# EAGLE design OPA4134 Headphones (EAGLE 7.6.0)
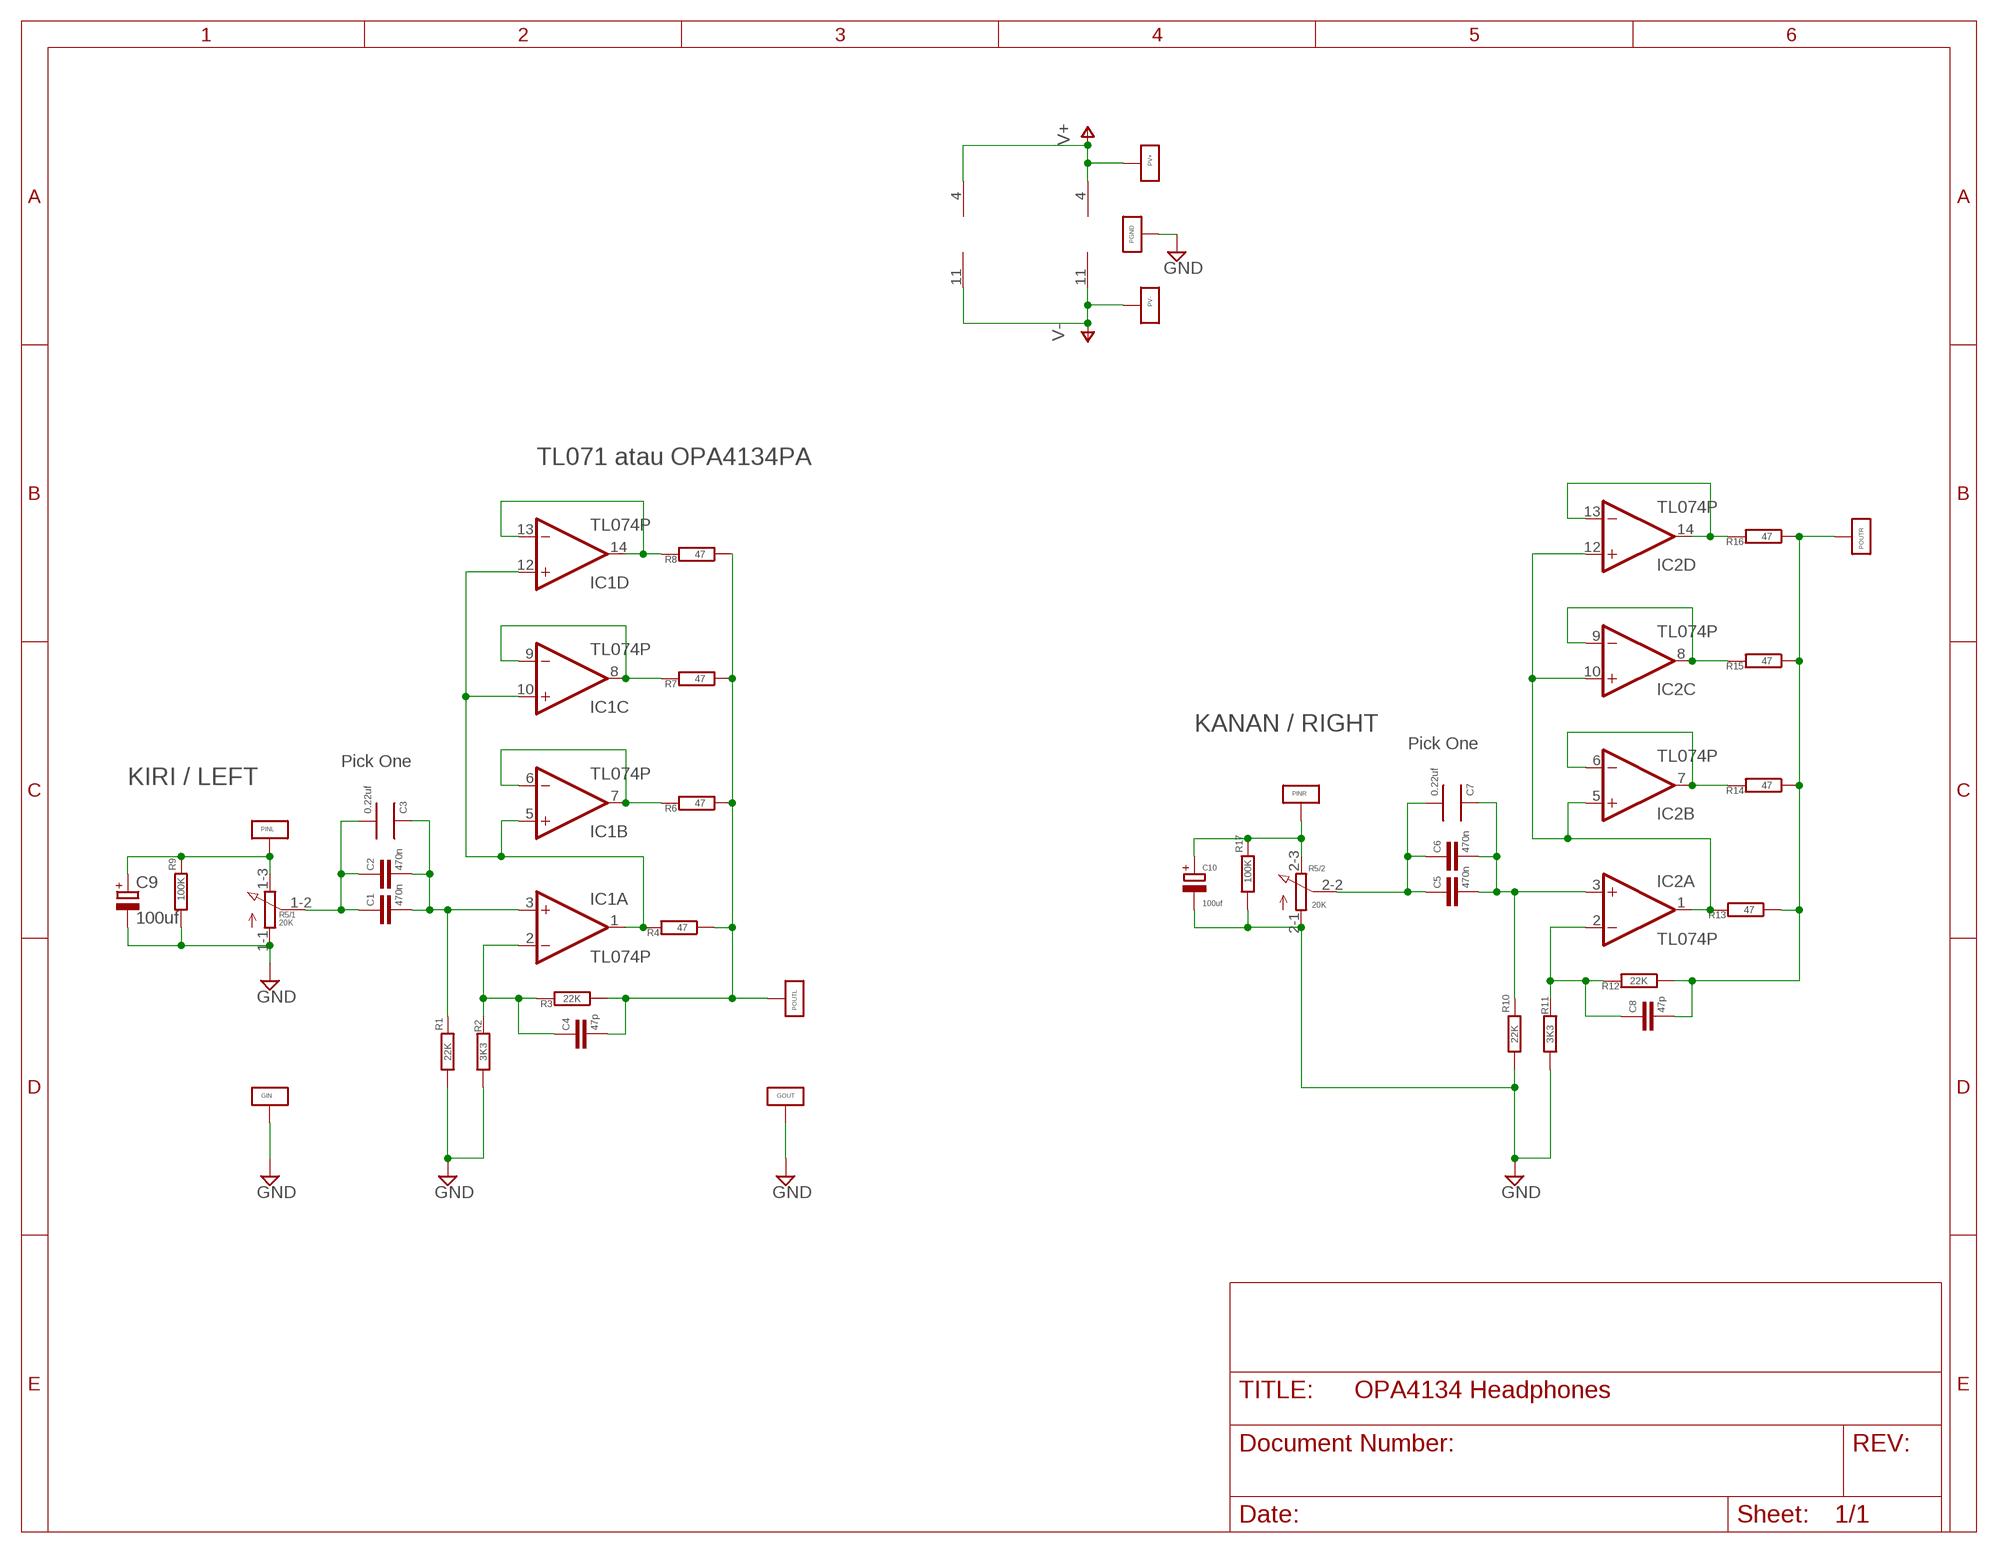
[diagram p0: schematic, sheet 1]

## Parts
C1  470n  C-EU050-025X075  [C050-025X075]
C2  470n  C-EU102-054X133  [C102-054X133]
C3  0.22uf  BENICCAPBENIC-SMALL  [BENICCAP]
C4  47p  C-EU050-025X075  [C050-025X075]
C5  470n  C-EU050-025X075  [C050-025X075]
C6  470n  C-EU102-054X133  [C102-054X133]
C7  0.22uf  BENICCAPBENIC-SMALL  [BENICCAP]
C8  47p  C-EU050-025X075  [C050-025X075]
C9  100uf  CPOL-EUE2.5-7  [E2,5-7]
C10  100uf  CPOL-EUE2.5-7  [E2,5-7]
GIN  PIN-BIG1X  [PIN-BIG]
GOUT  PIN-BIG1X  [PIN-BIG]
IC1  TL074P  [DIL14]
IC2  TL074P  [DIL14]
PGND  PIN-BIG1X  [PIN-BIG]
PINL  PIN-BIG1X  [PIN-BIG]
PINR  PIN-BIG1X  [PIN-BIG]
POUTL  PIN-BIG1X  [PIN-BIG]
POUTR  PIN-BIG1X  [PIN-BIG]
PV+  PIN-BIG1X  [PIN-BIG]
PV-  PIN-BIG1X  [PIN-BIG]
R1  22K  R-EU_0204/7  [0204/7]
R2  3K3  R-EU_0204/7  [0204/7]
R3  22K  R-EU_0204/7  [0204/7]
R4  47  R-EU_0204/7  [0204/7]
R5  20K  3RP/1610G  [3RP/1610G]
R6  47  R-EU_0204/7  [0204/7]
R7  47  R-EU_0204/7  [0204/7]
R8  47  R-EU_0204/7  [0204/7]
R9  100K  R-EU_0204/7  [0204/7]
R10  22K  R-EU_0204/7  [0204/7]
R11  3K3  R-EU_0204/7  [0204/7]
R12  22K  R-EU_0204/7  [0204/7]
R13  47  R-EU_0204/7  [0204/7]
R14  47  R-EU_0204/7  [0204/7]
R15  47  R-EU_0204/7  [0204/7]
R16  47  R-EU_0204/7  [0204/7]
R17  100K  R-EU_0204/7  [0204/7]

## Nets
GND: C9.- C10.- GIN.P$1 GOUT.P$1 PGND.P$1 R1.1 R2.1 R5.1-1(/1:A) R5.2-1(/2:A) R9.1 R10.1 R11.1 R17.1
N$1: C1.1 C2.1 C3.PIN1 R5.1-2(/1:S)
N$2: C1.2 C2.2 C3.PIN2 IC1.3(A:+IN) R1.2
N$3: IC1.6(B:-IN) IC1.7(B:OUT) R6.2
N$4: C4.1 IC1.2(A:-IN) R2.2 R3.2
N$5: IC1.1(A:OUT) IC1.5(B:+IN) IC1.10(C:+IN) IC1.12(D:+IN) R4.2
N$6: C4.2 POUTL.P$1 R3.1 R4.1 R6.1 R7.1 R8.1
N$7: C10.+ PINR.P$1 R5.2-3(/2:E) R17.2
N$8: IC1.8(C:OUT) IC1.9(C:-IN) R7.2
N$9: IC1.13(D:-IN) IC1.14(D:OUT) R8.2
N$10: C5.1 C6.1 C7.PIN1 R5.2-2(/2:S)
N$11: C5.2 C6.2 C7.PIN2 IC2.3(A:+IN) R10.2
N$12: C8.1 IC2.2(A:-IN) R11.2 R12.2
N$13: IC2.1(A:OUT) IC2.5(B:+IN) IC2.10(C:+IN) IC2.12(D:+IN) R13.2
N$14: C8.2 POUTR.P$1 R12.1 R13.1 R14.1 R15.1 R16.1
N$15: IC2.6(B:-IN) IC2.7(B:OUT) R14.2
N$16: IC2.8(C:OUT) IC2.9(C:-IN) R15.2
N$17: IC2.13(D:-IN) IC2.14(D:OUT) R16.2
N$18: C9.+ PINL.P$1 R5.1-3(/1:E) R9.2
V+: IC1.4(P:V+) IC2.4(P:V+) PV+.P$1
V-: IC1.11(P:V-) IC2.11(P:V-) PV-.P$1

## Notes on the sheet
- TL071 atau OPA4134PA
- KANAN / RIGHT
- Pick One
- Pick One
- KIRI / LEFT

## Library data of the parts
C1 C2 C4-C6 C8 = resistor:C-EU: CAPACITOR, European symbol
C3 C7 = ioshub:BENICCAP: Benic Capacitor Small
C9 C10 = resistor:CPOL-EU: POLARIZED CAPACITOR, European symbol
GIN GOUT PGND PINL PINR POUTL POUTR PV+ PV- = ioshub:PIN-BIG: 1X 1.0 mm pin big
IC1 IC2 = linear:TL074: OP AMP
R1-R4 R6-R17 = resistor:R-EU_: RESISTOR, European symbol
R5 = pot2:3RP/1610G: 16mm Potentiometer two level Source: http://www.alphapotentiometers.net/html/16mm_pot_2.html

## Board
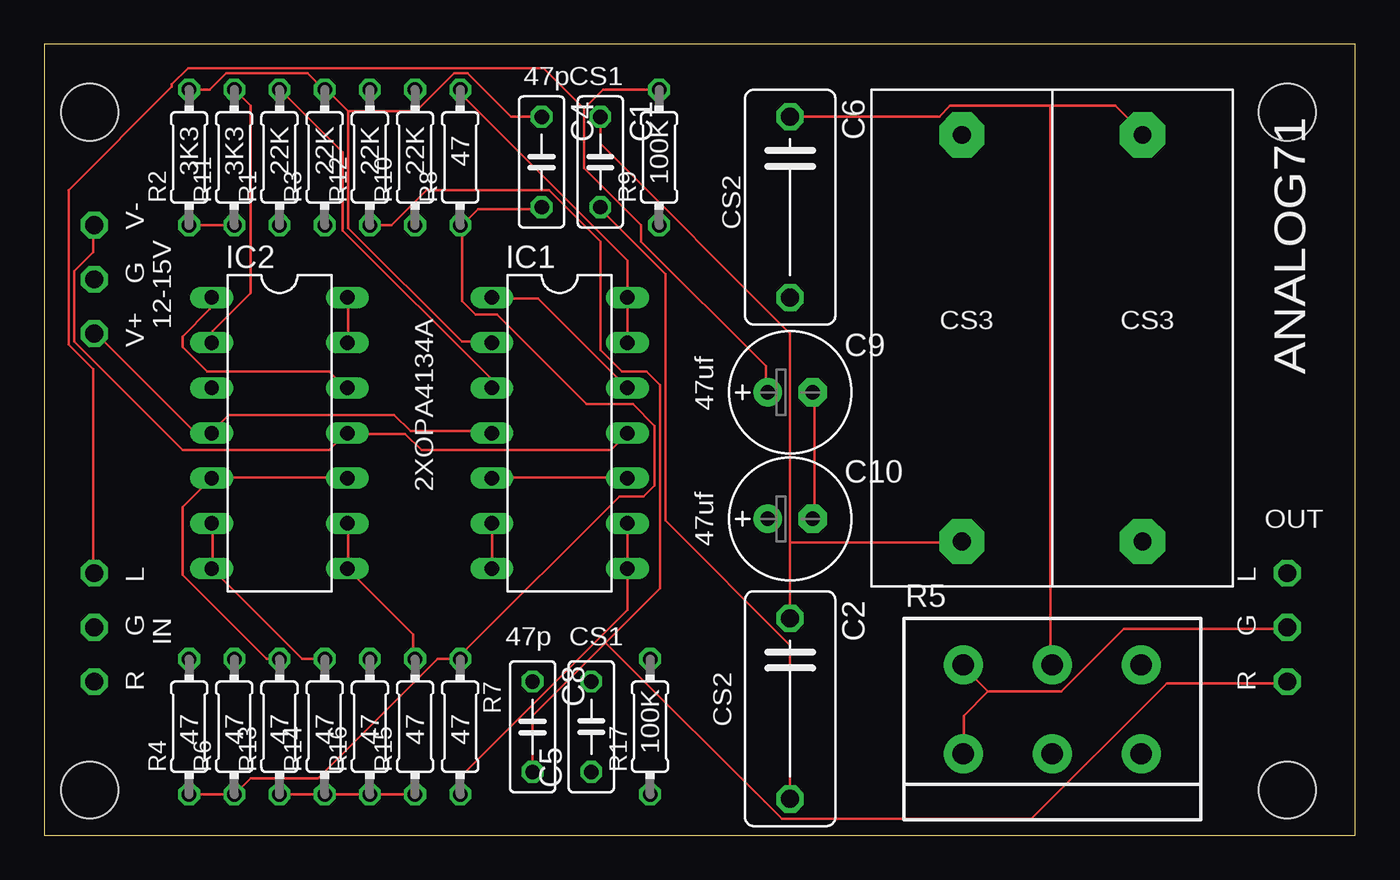
[diagram p1: board, top side]
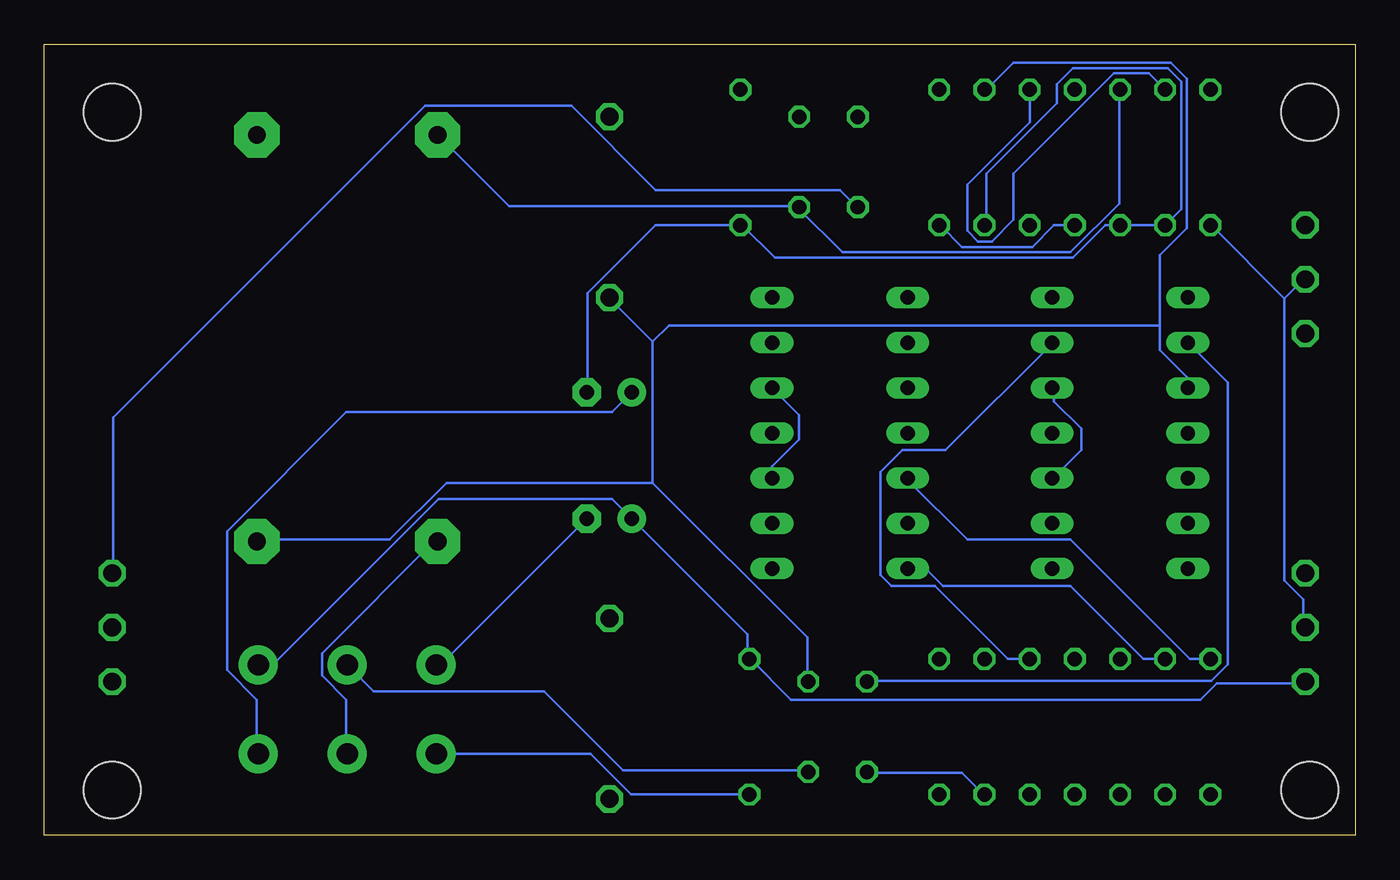
[diagram p2: board, bottom side, seen from below]

Size 73.66 x 44.45 mm. Coordinates in mm from the lower left corner, seen from the top.
Outline: 0,0 73.66,0 73.66,44.45 0,44.45 0,0
Copper layers (1*16): Top 0.035mm / dielectric 1.6mm / Bottom 0.035mm
Design rules "Elecrow_2-layer_PCB_eagle_rule": minimum track width 6mil, minimum drill 12mil, track to track 6mil, track to pad 8mil, pad to pad 12mil, via to via 12mil, smd to smd 0mil, copper to edge 20mil, drill to drill 10mil, minimum pad ring 6mil, minimum via ring 6mil, stop-mask expansion 0mil, vias tented up to drill 100mil, thermal gap 10mil
Holes 3.2 mm at 2.54,2.54 2.54,40.64 69.85,40.64 69.85,2.54

### Footprints (pad centres in the part's own frame; a part is rotated, then mirrored left to right if it is on the bottom)
C050-025X075 = drill 0.813 octagon: 1 -2.54,0; 2 2.54,0
C102-054X133 = drill 1.016 octagon: 1 -5.08,0; 2 5.08,0
BENICCAP = drill 1 pad 2.54 octagon: PIN1 -10.16,0; PIN2 12.7,0
E2,5-7 = drill 0.813 pad 1.6: + -1.27,0 | drill 0.813 pad 1.6 octagon: - 1.27,0
PIN-BIG = drill 1 octagon: P$1 0,0
DIL14 = drill 0.813 long: 1 -7.62,-3.81; 2 -5.08,-3.81; 3 -2.54,-3.81; 4 0,-3.81; 5 2.54,-3.81; 6 5.08,-3.81; 7 7.62,-3.81; 8 7.62,3.81; 9 5.08,3.81; 10 2.54,3.81; 11 0,3.81; 12 -2.54,3.81; 13 -5.08,3.81; 14 -7.62,3.81
0204/7 = drill 0.813 octagon: 1 -3.81,0; 2 3.81,0
3RP/1610G = drill 1.2 pad 2.184: 1-1 -5,0; 1-2 0,0; 1-3 5,0; 2-1 -5,5; 2-2 0,5; 2-3 5,5

### Placement (x,y rotation side)
C1  31.24,37.85 270 top
C2  41.91,7.11 270 top
C3  51.56,26.67 90 top
C4  27.94,37.85 270 top
C5  30.73,6.1 90 top
C6  41.91,35.31 270 top
C7  61.72,29.21 270 top
C8  27.43,6.1 270 top
C9  41.91,24.89 0 top
C10  41.91,17.78 0 top
GIN  2.79,11.68 0 top
GOUT  69.85,11.68 0 top
IC1  28.96,22.61 270 top
IC2  13.21,22.61 270 top
PGND  2.79,31.24 0 top
PINL  2.79,14.73 0 top
PINR  2.79,8.64 0 top
POUTL  69.85,14.73 0 top
POUTR  69.85,8.64 0 top
PV+  2.79,28.19 0 top
PV-  2.79,34.29 0 top
R1  13.21,38.1 90 top
R2  8.13,38.1 90 top
R3  15.75,38.1 90 top
R4  8.13,6.1 90 top
R5  56.64,4.57 0 top
R6  10.67,6.1 90 top
R7  23.37,6.1 270 top
R8  23.37,38.1 90 top
R9  34.54,38.1 90 top
R10  20.83,38.1 90 top
R11  10.67,38.1 90 top
R12  18.29,38.1 90 top
R13  13.21,6.1 90 top
R14  15.75,6.1 90 top
R15  20.83,6.1 90 top
R16  18.29,6.1 90 top
R17  34.04,6.1 90 top

### Tracks (layer width: path | path; a pad name or v marks a point on that pad's centre or on a via)
GND
  Top 0.152: R11.1 R2.1 | C10.- 43.28,17.83 43.28,24.84 C9.- | 53.03,8.08 57.15,8.08 60.66,11.58 69.8,11.58 GOUT.P$1 | 53.03,8.08 51.66,9.45 R5.2-1 | 53.03,8.08 51.66,6.71 51.66,4.57 R5.1-1
  Bottom 0.152: R10.1 20.73,34.29 20.73,37.19 16.76,41.15 16.76,42.22 15.85,43.13 10.52,43.13 9.75,42.37 9.75,35.2 R11.1 R1.1 14.02,34.29 15.85,32.46 32.61,32.46 34.44,34.29 R9.1 39.32,34.29 43.13,30.48 43.13,24.99 C9.- | 3.96,30.18 3.96,14.33 2.9,13.26 2.9,11.73 GIN.P$1 | 3.96,30.18 2.9,31.24 PGND.P$1 | 3.96,30.18 8.08,34.29 R2.1 | R17.1 40.69,2.29 42.98,4.57 R5.1-1 | C10.- 51.51,9.45 R5.2-1
N$1
  Top 0.152: C1.1 31.24,38.86 41.91,28.19 41.91,16.46 | C2.1 41.91,16.46 | 41.91,16.46 51.51,16.46 C3.PIN1
  Bottom 0.152: R5.1-2 56.69,4.57 56.69,7.62 58.06,8.99 58.06,10.21 51.66,16.61 C3.PIN1
N$2
  Top 0.152: IC1.3 25.15,25.6 16.76,33.98 16.76,38.41 13.26,41.91 R1.2 | C2.2 41.91,10.67 34.9,17.68 34.9,31.55 31.24,35.2 C1.2
  Bottom 0.152: C3.PIN2 47.55,35.36 31.24,35.36 C1.2 31.24,35.2 28.8,32.77 16,32.77 13.26,35.51 13.26,41.91 R1.2
N$3
  Top 0.152: IC1.7 IC1.6
  Bottom 0.152: R6.2 11.89,9.91 16,14.02 23.16,14.02 24.08,14.94 25.15,14.94 IC1.7
N$4
  Top 0.152: 17.07,40.69 17.07,34.14 23.47,27.74 25.15,27.74 IC1.2 | 17.07,40.69 15.85,41.91 R3.2 15.7,41.91 14.78,42.82 10.21,42.82 9.3,41.91 R2.2 | C4.1 26.21,40.39 23.77,42.82 23.01,42.82 20.88,40.69 17.07,40.69
N$5
  Top 0.152: IC1.12 27.74,30.18 25.15,30.18 IC1.1 | IC1.10 32.77,20.12 25.15,20.12 IC1.5
  Bottom 0.152: IC1.10 32.77,20.73 31.24,22.25 31.24,23.62 IC1.12 | R4.2 9.3,9.91 16,16.61 21.79,16.61 25.15,19.96 IC1.5
N$6
  Top 0.152: R4.1 R6.1 11.58,3.2 15.39,3.2 22.1,9.91 R7.1 23.47,9.91 23.47,10.21 32.31,19.05 33.68,19.05 34.29,19.66 34.29,23.01 33.07,24.23 30.48,24.23 25.45,29.26 24.23,29.26 23.47,30.02 23.47,34.29 | 23.47,34.29 24.38,35.2 27.89,35.2 C4.2 | 23.47,34.29 R8.1
  Bottom 0.152: R3.1 16.92,34.29 18.14,33.07 22.1,33.07 23.32,34.29 R8.1 | POUTL.P$1 69.8,14.78 69.8,23.47 52.27,41 44.04,41 39.32,36.27 28.96,36.27 28.04,35.36 C4.2
N$7
  Bottom 0.152: PINR.P$1 2.9,8.53 7.77,8.53 8.69,7.62 31.7,7.62 33.98,9.91 R17.2 34.14,9.91 34.14,11.28 C10.+ 41.76,18.9 51.51,18.9 60.81,9.6 61.57,9.6 R5.2-3
N$8
  Top 0.152: R7.2 23.47,2.29 23.47,3.35 32.77,12.65 IC1.8 IC1.9
N$9
  Top 0.152: IC1.13 IC1.14 32.77,32.31 23.47,41.6 23.47,41.91 R8.2
N$10
  Top 0.152: C6.1 50.29,40.39 50.9,41 56.54,41 | 56.54,41 60.2,41 61.72,39.47 C7.PIN1 | 56.54,41 56.54,9.6 R5.2-2
  Bottom 0.152: C5.1 30.79,3.66 41.15,3.66 45.57,8.08 55.17,8.08 56.54,9.45 R5.2-2
N$11
  Bottom 0.152: 10.97,28.65 10.97,32.61 9.45,34.14 9.45,42.52 10.36,43.43 19.2,43.43 20.73,41.91 R10.2 | 10.97,28.65 10.97,27.28 9.45,25.76 9.45,25.15 IC2.3 | 39.47,19.81 30.79,11.12 30.79,8.69 C5.2 | 39.47,27.74 39.47,19.81 | 39.47,27.74 41.91,30.18 C6.2 | 39.47,19.81 51.05,19.81 54.25,16.61 61.72,16.61 C7.PIN2 | 10.97,28.65 38.56,28.65 39.47,27.74
N$12
  Top 0.152: R11.2 11.58,41 11.58,30.48 9.45,28.35 9.45,27.74 IC2.2
  Bottom 0.152: R12.2 18.29,40.08 21.79,36.58 21.79,33.98 21.18,33.38 20.42,33.38 19.2,34.59 19.2,37.19 13.56,42.82 11.58,42.82 R11.2 | IC2.2 7.16,25.45 7.16,9.6 8.08,8.69 27.43,8.69 C8.1
N$13
  Top 0.152: IC2.10 16.92,20.12 9.45,20.12 IC2.5 7.77,18.44 7.77,14.63 12.5,9.91 R13.2 | IC2.1 9.3,30.18 9.3,29.57 7.77,28.04 7.77,27.43 9.14,26.06 16,26.06 16.92,25.15 IC2.12
  Bottom 0.152: IC2.12 16.92,25.15 16.92,24.38 15.39,22.86 15.39,21.64 16.92,20.12 IC2.10
N$14
  Top 0.152: R13.1 R14.1 R16.1 R15.1 | R12.1 19.51,34.29 21.49,36.27 28.35,36.27 31.24,33.38 31.24,27.28 32.46,26.06 33.83,26.06 34.59,25.3 34.59,13.87 31.55,10.82 | 31.55,10.82 27.43,6.71 C8.2 | 31.55,10.82 41.45,0.91 55.47,0.91 63.09,8.53 69.8,8.53 POUTR.P$1
  Bottom 0.152: C8.2 27.43,3.5 22.1,3.5 20.88,2.29 R15.1
N$15
  Top 0.152: R14.2 14.48,9.91 IC2.7 9.45,15.09 9.45,17.53 IC2.6
N$16
  Top 0.152: IC2.9 17.07,17.53 17.07,15.09 IC2.8 20.73,11.28 20.73,9.91 R15.2
N$17
  Top 0.152: IC2.13 17.07,27.74 17.07,30.18 IC2.14
  Bottom 0.152: R16.2 19.51,9.91 23.62,14.02 26.06,14.02 26.67,14.63 26.67,20.42 25.45,21.64 23.01,21.64 17.07,27.58 IC2.13
N$18
  Top 0.152: R9.2 31.39,41.91 30.33,40.84 | 30.33,40.84 30.33,37.49 33.53,34.29 33.53,33.38 40.54,26.36 40.54,24.99 C9.+ | 30.33,40.84 28.04,43.13 8.08,43.13 7.16,42.22 7.16,42.06 1.37,36.27 1.37,27.58 2.74,26.21 2.74,14.78 PINL.P$1
  Bottom 0.152: C9.+ 41.76,23.77 56.69,23.77 63.4,17.07 63.4,9.3 61.72,7.62 61.72,4.57 R5.1-3
V+
  Top 0.152: PV+.P$1 2.9,28.19 8.38,22.71 9.3,22.71 IC2.4 9.45,22.71 10.36,23.62 19.66,23.62 20.57,22.71 25.15,22.71 IC1.4
V-
  Top 0.152: IC1.11 32.77,22.55 31.85,21.64 21.18,21.64 20.27,22.55 17.07,22.55 IC2.11 16.92,22.55 16,21.64 7.77,21.64 1.68,27.74 1.68,31.7 2.74,32.77 2.74,34.29 PV-.P$1

### Text on the board
tPlace: 47p | CS1 | 47 | 3K3 | 3K3 | 22K | 22K | 22K | 22K | 100K | V- | CS2 | G | CS3 | CS3 | 12-15V | V+ | ANALOG71 | 47uf | 2XOPA4134A | OUT | 47uf | L | L | 47p | CS1 | G | IN | G | R | R | CS2 | 47 | 47 | 47 | 47 | 47 | 47 | 47 | 100K